# EasyEDA schematic controller_schematic.json
TITLE: Sheet_1; REV: 1.0; Date: 2024-05-04; Sheet: 1/1
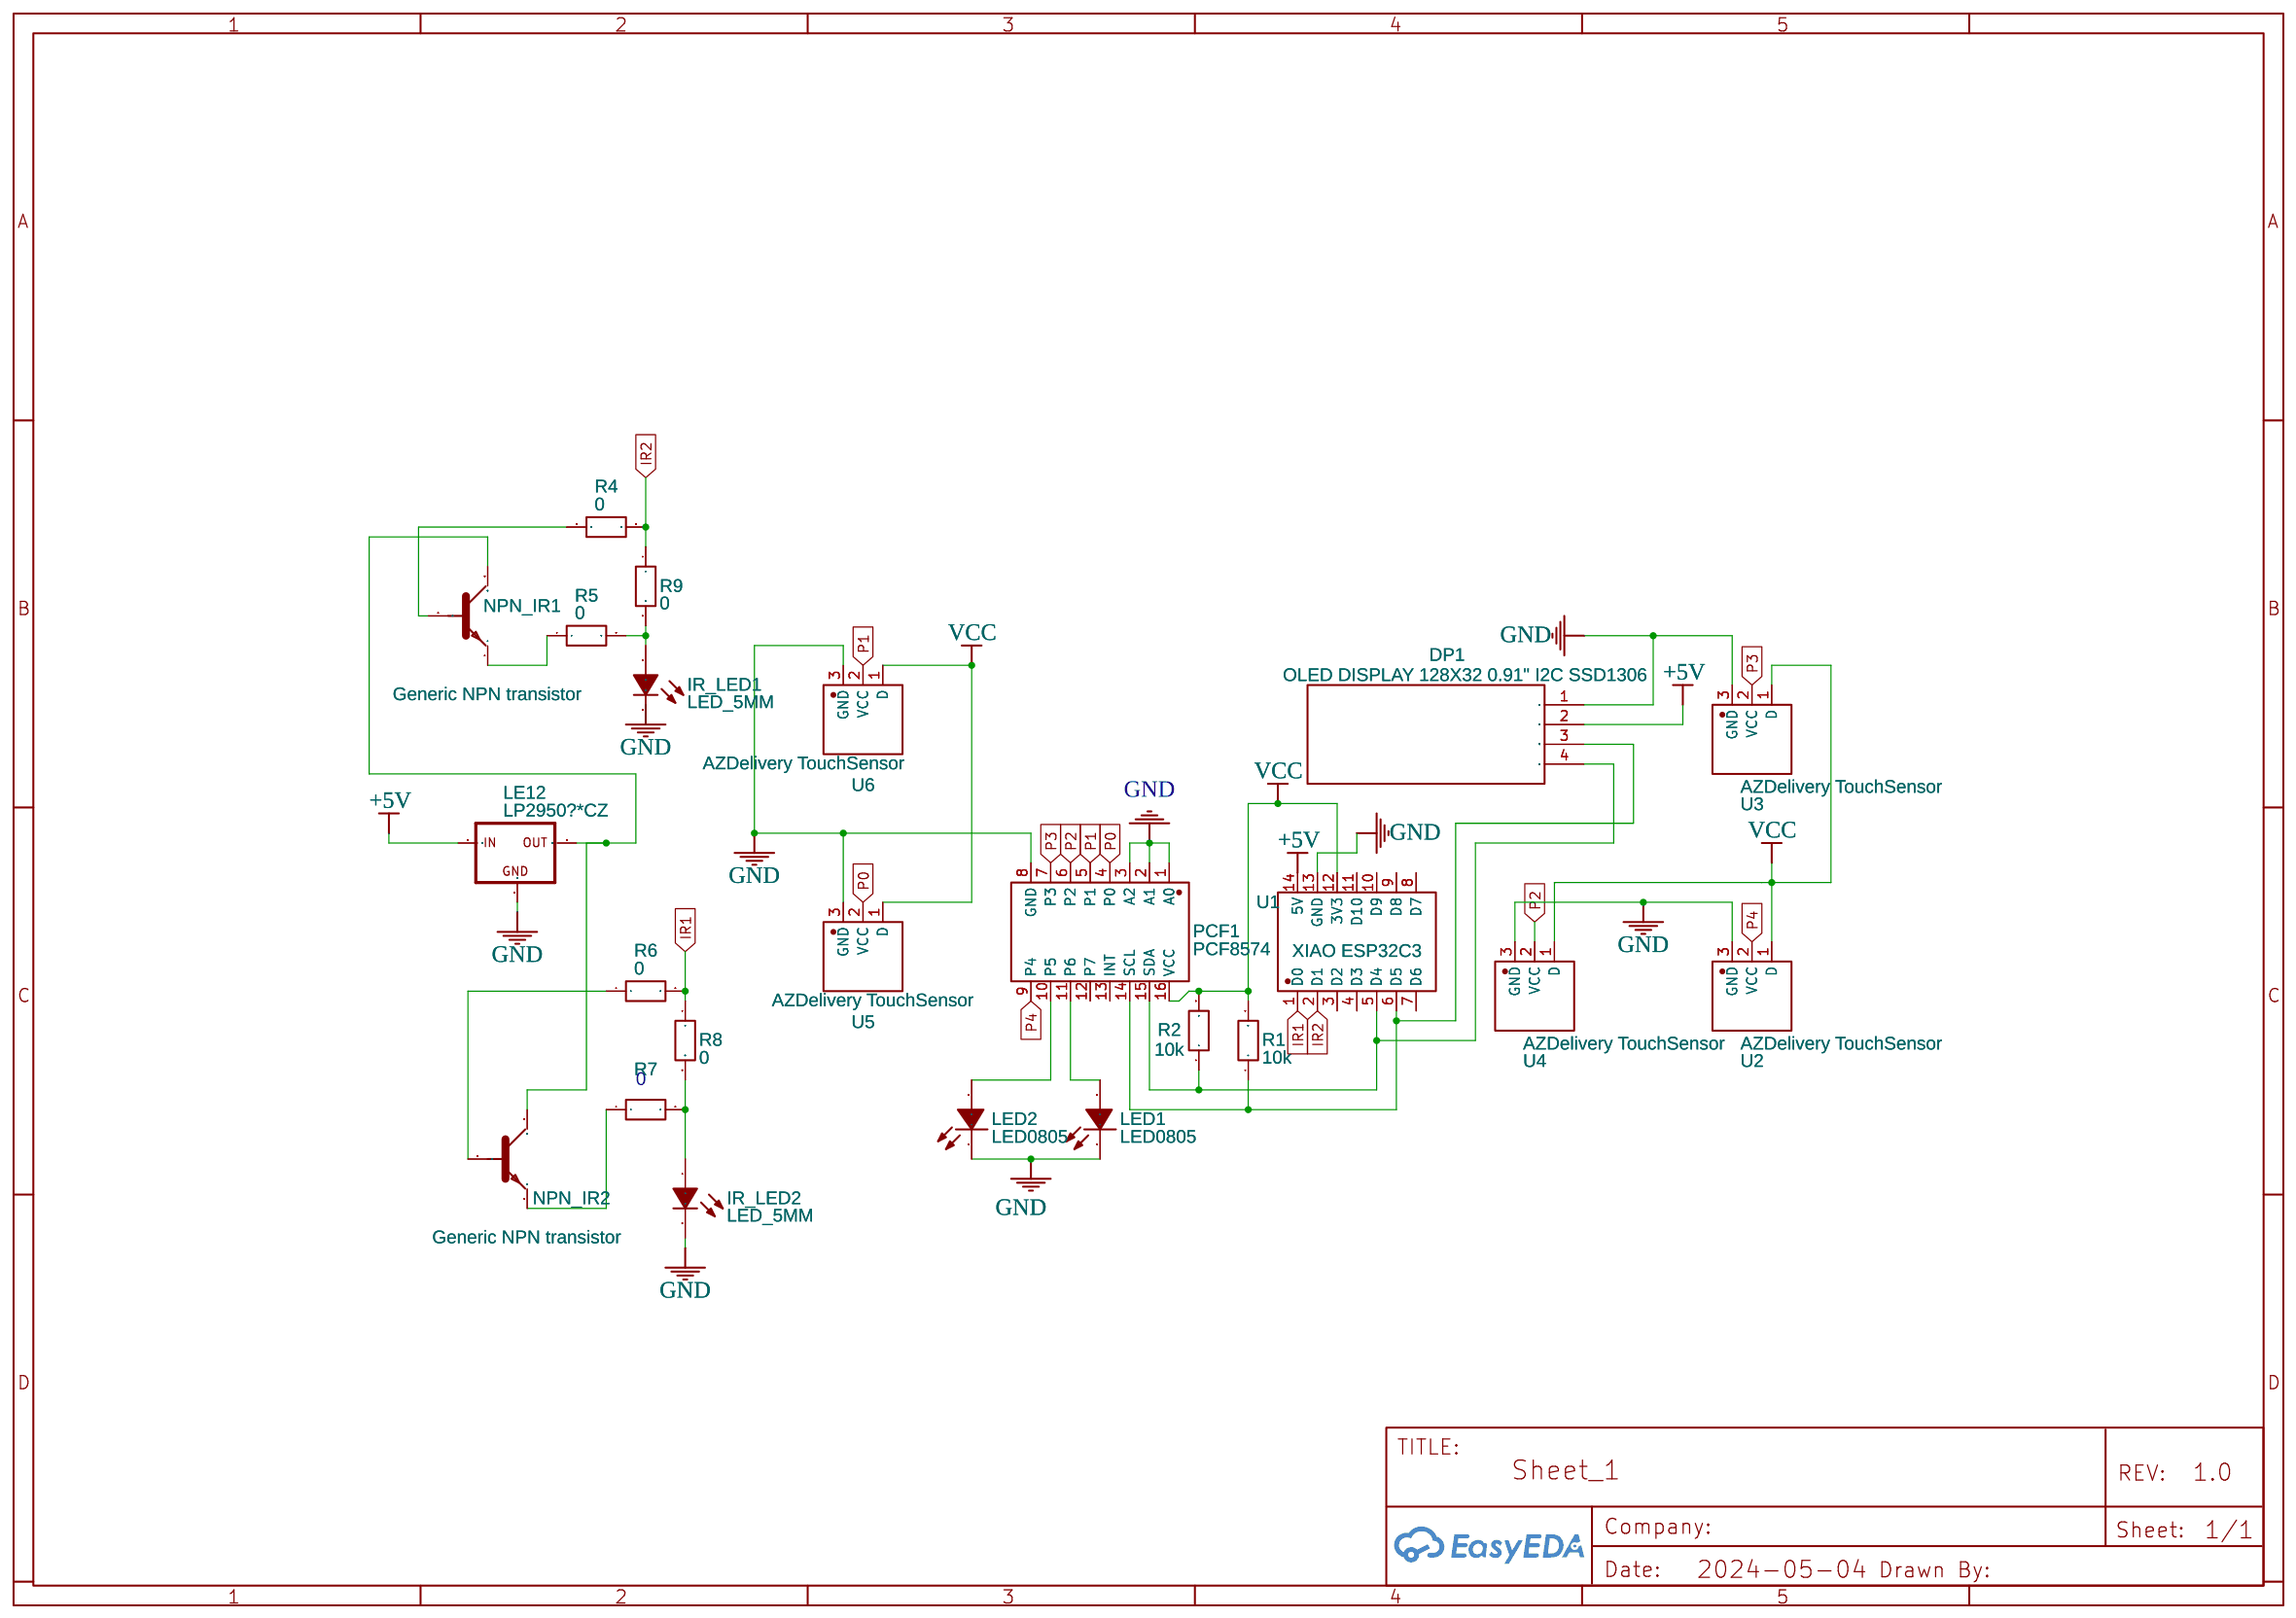
[diagram p0: schematic sheet]

## Parts
DP1  OLED DISPLAY 128X32 0.91" I2C SSD1306  [OLED-TH-C128-R64-D0.91-I2C-SSD1306]
IR_LED1  LED_5MM  [LED-TH_BD5.0-P2.54-FD_C9900023552]
IR_LED2  LED_5MM  [LED-TH_BD5.0-P2.54-FD_C9900023552]
LE12  LP2950?*CZ  [TO92]
LED1  LED0805  [LED0805-RD]
LED2  LED0805  [LED0805-RD]
NPN_IR1  Generic NPN transistor  [NPN-TO92-EBC]
NPN_IR2  Generic NPN transistor  [NPN-TO92-EBC]
PCF1  PCF8574  [PCF8574]
R1  10k  [R0603]
R2  10k  [R0603]
R4  0  [R0603]
R5  0  [R0603]
R6  0  [R0603]
R7  0  [R0603]
R8  0  [R0603]
R9  0  [R0603]
U1  XIAO ESP32C3  [COMM-SMD_KQ-2801_V106]
U2  AZDelivery TouchSensor  [TT223TOUCHSENSOR]
U3  AZDelivery TouchSensor  [TT223TOUCHSENSOR]
U4  AZDelivery TouchSensor  [TT223TOUCHSENSOR]
U5  AZDelivery TouchSensor  [TT223TOUCHSENSOR]
U6  AZDelivery TouchSensor  [TT223TOUCHSENSOR]

## Library data of the parts
DP1 = OLED DISPLAY 128X32 0.91" I2C SSD1306: Contributor: Ravi Shankar
IR_LED1 IR_LED2 = LED_5MM: Contributor: lcsc; Supplier: LCSC; Supplier Part: C9900023552; Manufacturer: null; JLCPCB Part Class: Extended Part
LE12 = LP2950?*CZ: Contributor: Jian James
LED1 LED2 = LED0805: Contributor: LCSC; Supplier: LCSC; Supplier Part: C9900012722; Manufacturer: null; Manufacturer Part: led0805; JLCPCB Part Class: Extended Part
NPN_IR1 NPN_IR2 = Generic NPN transistor: Contributor: single_coil_hum; Supplier: Mouser; Supplier Part: 610-PN2484; Manufacturer Part: PN2484 PBFREE; Manufacturer: Central Semiconductor; link: https://www.mouser.jp/ProductDetail/Central-Semiconductor/PN2484-PBFREE?qs=u16ybLDytRbm06O5%2F5J3lQ%3D%3D
PCF1 = PCF8574: Contributor: Guest
R1 R2 R4-R9 = R_0603_EU: Contributor: LCEDA_Lib
U1 = XIAO ESP32C3: Supplier: LCSC; Supplier Part: C19189385; Manufacturer: null; JLCPCB Part Class: Extended Part; Contributor: lcsc
U2-U6 = AZDelivery TouchSensor: Supplier Part: AZDelivery; Manufacturer: AZDelivery; Manufacturer Part: ZJY096S0700BG01蓝色; link: https://img.jlc.com/pdf/applyPasteComponent/2022-08-15/203417A/337c2d88c1b34c958220578f8c1ccd46/ZJY096S0700WG01.pdf; Contributor: ichdu; Convert to PCB: Yes; Add into BOM: Yes

## Nets
+5V: DP1.2(VCC) LE12.3(IN) U1.14(5V)
GND: DP1.1(GND) IR_LED1.2(K) IR_LED2.2(K) LE12.2(GND) LED1.1(-) LED2.1(-) PCF1.1(A0) PCF1.2(A1) PCF1.3(A2) PCF1.8(GND) U1.13(GND) U2.3(GND) U3.3(GND) U4.3(GND) U5.3(GND) U6.3(GND)
VCC: PCF1.16(VCC) R1.2 R2.2 U1.12(3V3) U2.1(D) U3.1(D) U4.1(D) U5.1(D) U6.1(D)
IR1: R6.2 R8.1 U1.1(D0)
IR2: R4.2 R9.1 U1.2(D1)
P0: PCF1.4(P0) U5.2(VCC)
P1: PCF1.5(P1) U6.2(VCC)
P2: PCF1.6(P2) U4.2(VCC)
P3: PCF1.7(P3) U3.2(VCC)
P4: PCF1.9(P4) U2.2(VCC)
Net-(DP1-3): DP1.3(SCL) PCF1.14(SCL) R1.1 U1.6(D5)
Net-(DP1-4): DP1.4(SDA) PCF1.15(SDA) R2.1 U1.5(D4)
Net-(IR_LED1-1): IR_LED1.1(A) R5.2 R9.2
Net-(IR_LED2-1): IR_LED2.1(A) R7.2 R8.2
Net-(LE12-1): LE12.1(OUT) NPN_IR1.3(C) NPN_IR2.3(C)
Net-(LED1-2): LED1.2(+) PCF1.11(P6)
Net-(LED2-2): LED2.2(+) PCF1.10(P5)
Net-(NPN_IR1-1): NPN_IR1.1(E) R5.1
Net-(NPN_IR1-2): NPN_IR1.2(B) R4.1
Net-(NPN_IR2-1): NPN_IR2.1(E) R7.1
Net-(NPN_IR2-2): NPN_IR2.2(B) R6.1

Not connected (* = marked no-connect by the designer): PCF1 12(P7) 13(INT); U1 3(D2) 4(D3) 7(D6) 8(D7) 9(D8) 10(D9) 11(D10)

## Notes on the sheet
- 0
